# EAGLE design practice_2022 (EAGLE 9.6.2)
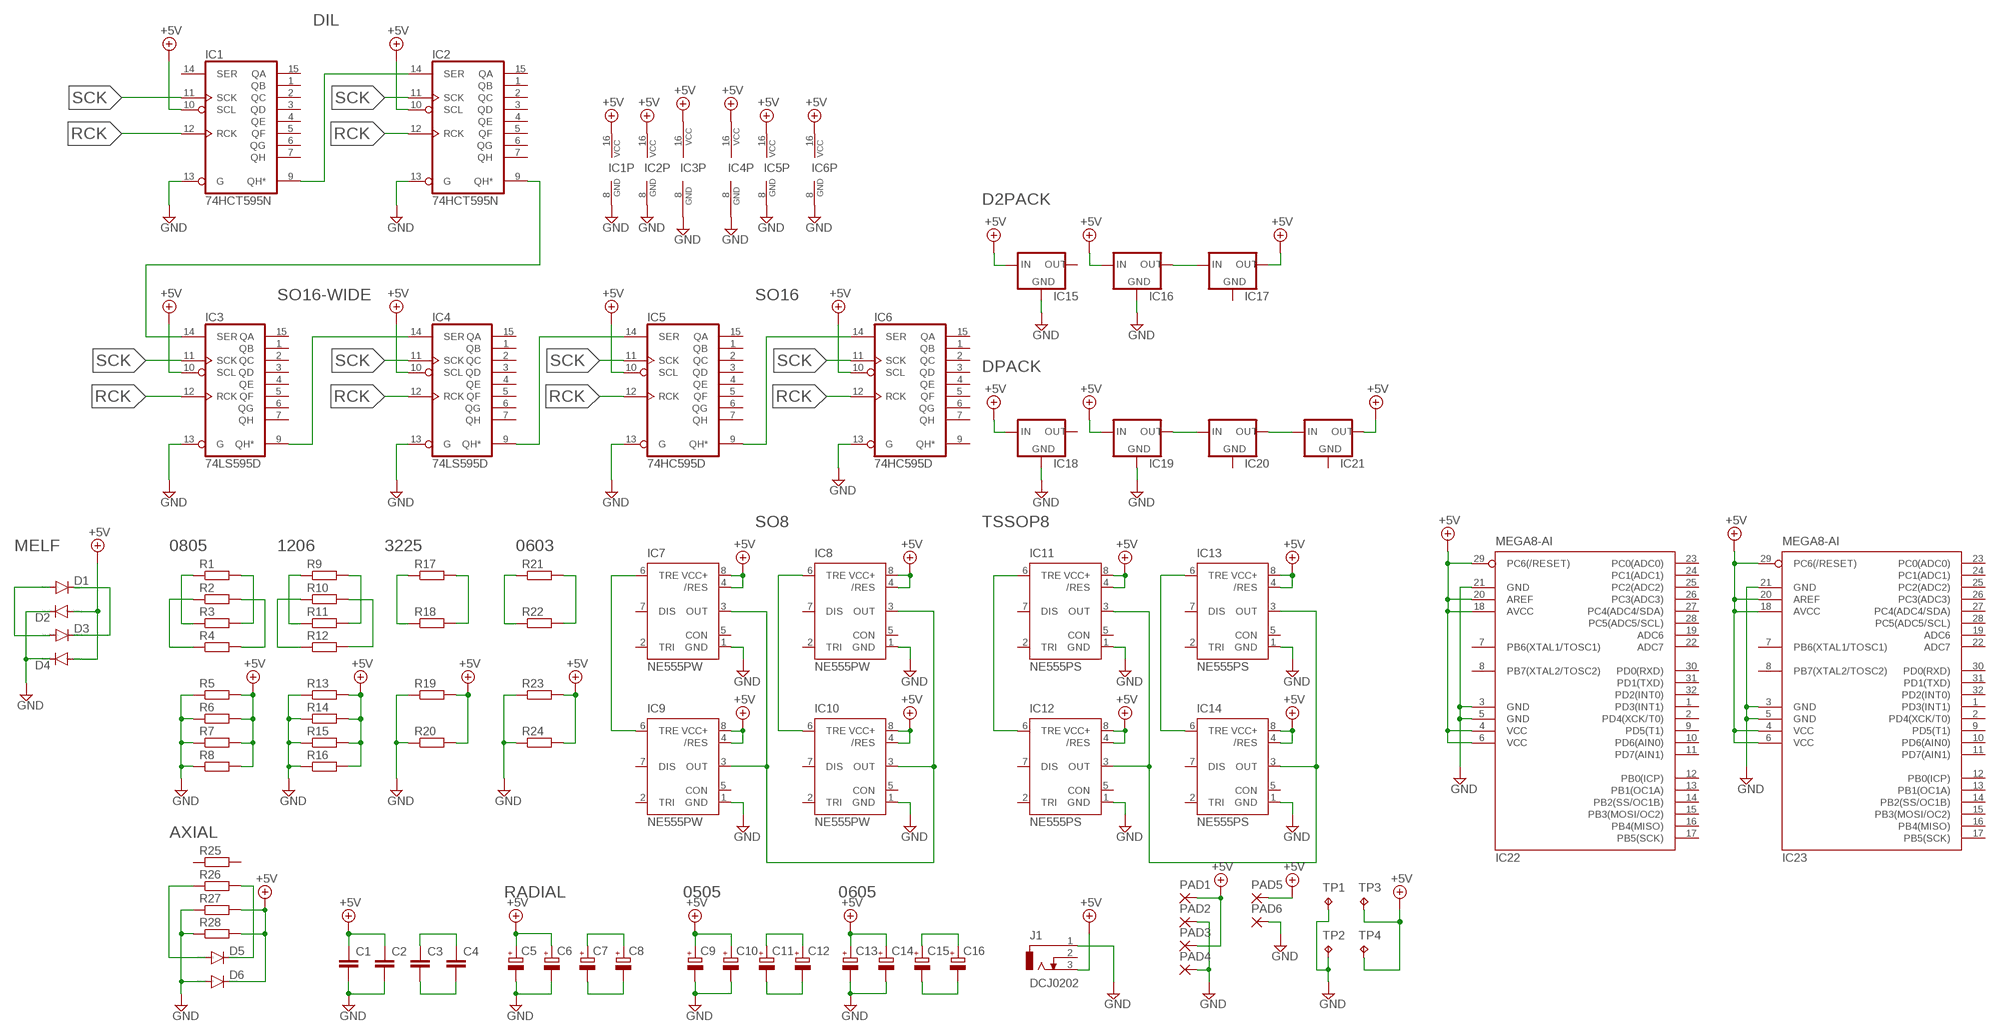
[diagram p0: schematic, sheet 1]

## Parts
C1  C-EU050-024X044  [C050-024X044]
C2  C-EU050-024X044  [C050-024X044]
C3  C-EU050-024X044  [C050-024X044]
C4  C-EU050-024X044  [C050-024X044]
C5  CPOL-EUE5-4  [E5-4]
C6  CPOL-EUE5-4  [E5-4]
C7  CPOL-EUE2,5-6E  [E2,5-6E]
C8  CPOL-EUE2,5-6E  [E2,5-6E]
C9  CPOL-EU153CLV-0505  [153CLV-0505]
C10  CPOL-EU153CLV-0505  [153CLV-0505]
C11  CPOL-EU153CLV-0505  [153CLV-0505]
C12  CPOL-EU153CLV-0505  [153CLV-0505]
C13  CPOL-EU153CLV-0605  [153CLV-0605]
C14  CPOL-EU153CLV-0605  [153CLV-0605]
C15  CPOL-EU153CLV-0605  [153CLV-0605]
C16  CPOL-EU153CLV-0605  [153CLV-0605]
D1  DIODE-MINIMELF  [MINIMELF]
D2  DIODE-MINIMELF  [MINIMELF]
D3  DIODE-MINIMELF  [MINIMELF]
D4  DIODE-MINIMELF  [MINIMELF]
D5  DIODE-DO35-10  [DO35-10]
D6  DIODE-DO35-10  [DO35-10]
IC1  74HCT595N  [DIL16]
IC2  74HCT595N  [DIL16]
IC3  74LS595D  [SO16]
IC4  74LS595D  [SO16]
IC5  74HC595D  [SO16]
IC6  74HC595D  [SO16]
IC7  NE555PW  [TSSOP8]
IC8  NE555PW  [TSSOP8]
IC9  NE555PW  [TSSOP8]
IC10  NE555PW  [TSSOP8]
IC11  NE555PS  [SO08]
IC12  NE555PS  [SO08]
IC13  NE555PS  [SO08]
IC14  NE555PS  [SO08]
IC15  78XX-D2PACK  [D2PACK]
IC16  78XX-D2PACK  [D2PACK]
IC17  78XX-D2PACK  [D2PACK]
IC18  78XX-DPACK  [DPACK]
IC19  78XX-DPACK  [DPACK]
IC20  78XX-DPACK  [DPACK]
IC21  78XX-DPACK  [DPACK]
IC22  MEGA8-AI  [TQFP32-08]
IC23  MEGA8-AI  [TQFP32-08]
J1  DCJ0202  [DCJ0202]
PAD1  SMD2  [SMD1,27-2,54]
PAD2  SMD2  [SMD1,27-2,54]
PAD3  SMD5  [SMD2,54-5,08]
PAD4  SMD5  [SMD2,54-5,08]
PAD5  2,54/1,0  [2,54/1,0]
PAD6  2,54/1,0  [2,54/1,0]
R1  R-EU_R0805  [R0805]
R2  R-EU_R0805  [R0805]
R3  R-EU_R0805  [R0805]
R4  R-EU_R0805  [R0805]
R5  R-EU_R0805  [R0805]
R6  R-EU_R0805  [R0805]
R7  R-EU_R0805  [R0805]
R8  R-EU_R0805  [R0805]
R9  R-EU_R1206  [R1206]
R10  R-EU_R1206  [R1206]
R11  R-EU_R1206  [R1206]
R12  R-EU_R1206  [R1206]
R13  R-EU_R1206  [R1206]
R14  R-EU_R1206  [R1206]
R15  R-EU_R1206  [R1206]
R16  R-EU_R1206  [R1206]
R17  R-EU_R3225  [R3225]
R18  R-EU_R3225  [R3225]
R19  R-EU_R3225  [R3225]
R20  R-EU_R3225  [R3225]
R21  R-EU_R0603  [R0603]
R22  R-EU_R0603  [R0603]
R23  R-EU_R0603  [R0603]
R24  R-EU_R0603  [R0603]
R25  R-EU_0207/12  [0207/12]
R26  R-EU_0207/12  [0207/12]
R27  R-EU_0207/12  [0207/12]
R28  R-EU_0207/12  [0207/12]
TP1  TPTP20SQ  [TP20SQ]
TP2  TPTP20SQ  [TP20SQ]
TP3  TPTP06R  [TP06R]
TP4  TPTP06R  [TP06R]

## Nets
+5V: C1.1 C2.1 C5.+ C6.+ C9.+ C10.+ C13.+ C14.+ D2.A D4.A D6.C IC1.10(SCL) IC1.16(VCC) IC2.10(SCL) IC2.16(VCC) IC3.10(SCL) IC3.16(VCC) IC4.10(SCL) IC4.16(VCC) IC5.10(SCL) IC5.16(VCC) IC6.10(SCL) IC6.16(VCC) IC7.4(/RES) IC7.8(VCC+) IC8.4(/RES) IC8.8(VCC+) IC9.4(/RES) IC9.8(VCC+) IC10.4(/RES) IC10.8(VCC+) IC11.4(/RES) IC11.8(VCC+) IC12.4(/RES) IC12.8(VCC+) IC13.4(/RES) IC13.8(VCC+) IC14.4(/RES) IC14.8(VCC+) IC15.1(IN) IC16.1(IN) IC17.3(OUT) IC18.1(IN) IC19.1(IN) IC21.3(OUT) IC22.4(VCC) IC22.6(VCC) IC22.18(AVCC) IC22.20(AREF) IC22.29(PC6(/RESET)) IC23.4(VCC) IC23.6(VCC) IC23.18(AVCC) IC23.20(AREF) IC23.29(PC6(/RESET)) J1.3 PAD1.1(P) PAD3.1(P) PAD5.1(P) R5.2 R6.2 R7.2 R8.2 R13.2 R14.2 R15.2 R16.2 R19.2 R20.2 R23.2 R24.2 R27.2 R28.2 TP3.TP TP4.TP
GND: C1.2 C2.2 C5.- C6.- C9.- C10.- C13.- C14.- D2.C D4.C D6.A IC1.8(GND) IC1.13(G) IC2.8(GND) IC2.13(G) IC3.8(GND) IC3.13(G) IC4.8(GND) IC4.13(G) IC5.8(GND) IC5.13(G) IC6.8(GND) IC6.13(G) IC7.1(GND) IC8.1(GND) IC9.1(GND) IC10.1(GND) IC11.1(GND) IC12.1(GND) IC13.1(GND) IC14.1(GND) IC15.2(GND) IC16.2(GND) IC18.4(GND) IC19.4(GND) IC22.3(GND) IC22.5(GND) IC22.21(GND) IC23.3(GND) IC23.5(GND) IC23.21(GND) J1.1 PAD2.1(P) PAD4.1(P) PAD6.1(P) R5.1 R6.1 R7.1 R8.1 R13.1 R14.1 R15.1 R16.1 R19.1 R20.1 R23.1 R24.1 R27.1 R28.1 TP1.TP TP2.TP
N$1: IC1.9(QH*) IC2.14(SER)
N$2: R1.2 R3.2
N$3: IC4.9(QH*) IC5.14(SER)
N$4: IC5.9(QH*) IC6.14(SER)
N$5: IC2.9(QH*) IC3.14(SER)
N$6: IC3.9(QH*) IC4.14(SER)
N$7: R1.1 R3.1
N$8: R2.1 R4.1
N$9: R2.2 R4.2
N$10: R9.1 R11.1
N$11: R10.1 R12.1
N$12: R9.2 R11.2
N$13: R10.2 R12.2
N$14: R17.1 R18.1
N$15: R17.2 R18.2
N$16: R21.1 R22.1
N$17: R21.2 R22.2
N$18: IC7.3(OUT) IC8.3(OUT) IC9.3(OUT) IC10.3(OUT)
N$19: IC7.6(TRE) IC9.6(TRE)
N$20: IC8.6(TRE) IC10.6(TRE)
N$21: IC11.3(OUT) IC12.3(OUT) IC13.3(OUT) IC14.3(OUT)
N$22: IC11.6(TRE) IC12.6(TRE)
N$23: D1.A D3.A
N$24: D1.C D3.C
N$25: IC13.6(TRE) IC14.6(TRE)
N$26: IC16.3(OUT) IC17.1(IN)
N$27: IC19.3(OUT) IC20.1(IN)
N$28: IC20.3(OUT) IC21.1(IN)
N$29: D5.A R26.1
N$30: D5.C R26.2
N$31: C3.2 C4.2
N$32: C3.1 C4.1
N$36: C7.+ C8.+
N$37: C7.- C8.-
N$38: C11.+ C12.+
N$39: C11.- C12.-
N$40: C15.+ C16.+
N$41: C15.- C16.-
RCK: IC1.12(RCK) IC2.12(RCK) IC3.12(RCK) IC4.12(RCK) IC5.12(RCK) IC6.12(RCK)
SCK: IC1.11(SCK) IC2.11(SCK) IC3.11(SCK) IC4.11(SCK) IC5.11(SCK) IC6.11(SCK)
Unconnected: IC1.1(QB) IC1.2(QC) IC1.3(QD) IC1.4(QE) IC1.5(QF) IC1.6(QG) IC1.7(QH) IC1.14(SER) IC1.15(QA) IC2.1(QB) IC2.2(QC) IC2.3(QD) IC2.4(QE) IC2.5(QF) IC2.6(QG) IC2.7(QH) IC2.15(QA) IC3.1(QB) IC3.2(QC) IC3.3(QD) IC3.4(QE) IC3.5(QF) IC3.6(QG) IC3.7(QH) IC3.15(QA) IC4.1(QB) IC4.2(QC) IC4.3(QD) IC4.4(QE) IC4.5(QF) IC4.6(QG) IC4.7(QH) IC4.15(QA) IC5.1(QB) IC5.2(QC) IC5.3(QD) IC5.4(QE) IC5.5(QF) IC5.6(QG) IC5.7(QH) IC5.15(QA) IC6.1(QB) IC6.2(QC) IC6.3(QD) IC6.4(QE) IC6.5(QF) IC6.6(QG) IC6.7(QH) IC6.9(QH*) IC6.15(QA) IC7.2(TRI) IC7.5(CON) IC7.7(DIS) IC8.2(TRI) IC8.5(CON) IC8.7(DIS) IC9.2(TRI) IC9.5(CON) IC9.7(DIS) IC10.2(TRI) IC10.5(CON) IC10.7(DIS) IC11.2(TRI) IC11.5(CON) IC11.7(DIS) IC12.2(TRI) IC12.5(CON) IC12.7(DIS) IC13.2(TRI) IC13.5(CON) IC13.7(DIS) IC14.2(TRI) IC14.5(CON) IC14.7(DIS) IC15.3(OUT) IC17.2(GND) IC18.3(OUT) IC20.4(GND) IC21.4(GND) IC22.1(PD3(INT1)) IC22.2(PD4(XCK/T0)) IC22.7(PB6(XTAL1/TOSC1)) IC22.8(PB7(XTAL2/TOSC2)) IC22.9(PD5(T1)) IC22.10(PD6(AIN0)) IC22.11(PD7(AIN1)) IC22.12(PB0(ICP)) IC22.13(PB1(OC1A)) IC22.14(PB2(SS/OC1B)) IC22.15(PB3(MOSI/OC2)) IC22.16(PB4(MISO)) IC22.17(PB5(SCK)) IC22.19(ADC6) IC22.22(ADC7) IC22.23(PC0(ADC0)) IC22.24(PC1(ADC1)) IC22.25(PC2(ADC2)) IC22.26(PC3(ADC3)) IC22.27(PC4(ADC4/SDA)) IC22.28(PC5(ADC5/SCL)) IC22.30(PD0(RXD)) IC22.31(PD1(TXD)) IC22.32(PD2(INT0)) IC23.1(PD3(INT1)) IC23.2(PD4(XCK/T0)) IC23.7(PB6(XTAL1/TOSC1)) IC23.8(PB7(XTAL2/TOSC2)) IC23.9(PD5(T1)) IC23.10(PD6(AIN0)) IC23.11(PD7(AIN1)) IC23.12(PB0(ICP)) IC23.13(PB1(OC1A)) IC23.14(PB2(SS/OC1B)) IC23.15(PB3(MOSI/OC2)) IC23.16(PB4(MISO)) IC23.17(PB5(SCK)) IC23.19(ADC6) IC23.22(ADC7) IC23.23(PC0(ADC0)) IC23.24(PC1(ADC1)) IC23.25(PC2(ADC2)) IC23.26(PC3(ADC3)) IC23.27(PC4(ADC4/SDA)) IC23.28(PC5(ADC5/SCL)) IC23.30(PD0(RXD)) IC23.31(PD1(TXD)) IC23.32(PD2(INT0)) J1.2 R25.1 R25.2

## Notes on the sheet
- DIL
- D2PACK
- SO16-WIDE | SO16
- DPACK
- SO8 | TSSOP8
- MELF | 0805 | 1206 | 3225 | 0603
- AXIAL
- RADIAL | 0505 | 0605

## Library data of the parts
C1-C4 = rcl:C-EU: CAPACITOR, European symbol; SPICEPREFIX: C
C5-C16 = rcl:CPOL-EU: POLARIZED CAPACITOR, European symbol; SPICEPREFIX: C
D1-D6 = diode:DIODE-: DIODE
IC1 IC2 IC5 IC6 = 74xx-eu:74*595: 8-bit SHIFT REGISTER, output latch
IC3 IC4 = 74xx-jp:74*595: 8-bit SHIFT REGISTER, output latch
IC7-IC14 = toyota:NE555: General purpose bipolar Timer
IC15-IC21 = toyota:78XX: VOLTAGE REGULATOR
IC22 IC23 = atmel:MEGA8: MICROCONTROLLER 8 Kbytes FLASH, 1 kbytes SRAM, 512 bytes EEPROM, USART, 6-channel 10 bit ADC, 2-channel 8 bit ADC Pin compatible with Atmega48, ATMega88, ATMega168 Source: avr.lbr; MPN: ATMEGA8-16AU; OC_FARNELL: 9171371; OC_NEWARK: 73M8863
J1 = con-jack:DCJ0202: DC POWER JACK Source: DCJ0202.pdf; OC_FARNELL: unknown; OC_NEWARK: unknown
PAD1 PAD2 = wirepad:SMD2: SMD PAD
PAD3 PAD4 = wirepad:SMD5: SMD PAD
PAD5 PAD6 = wirepad:2,54/1,0: THROUGH-HOLE PAD
R1-R28 = rcl:R-EU_: RESISTOR, European symbol; SPICEPREFIX: R
TP1-TP4 = testpad:TP: Test pad

## Board
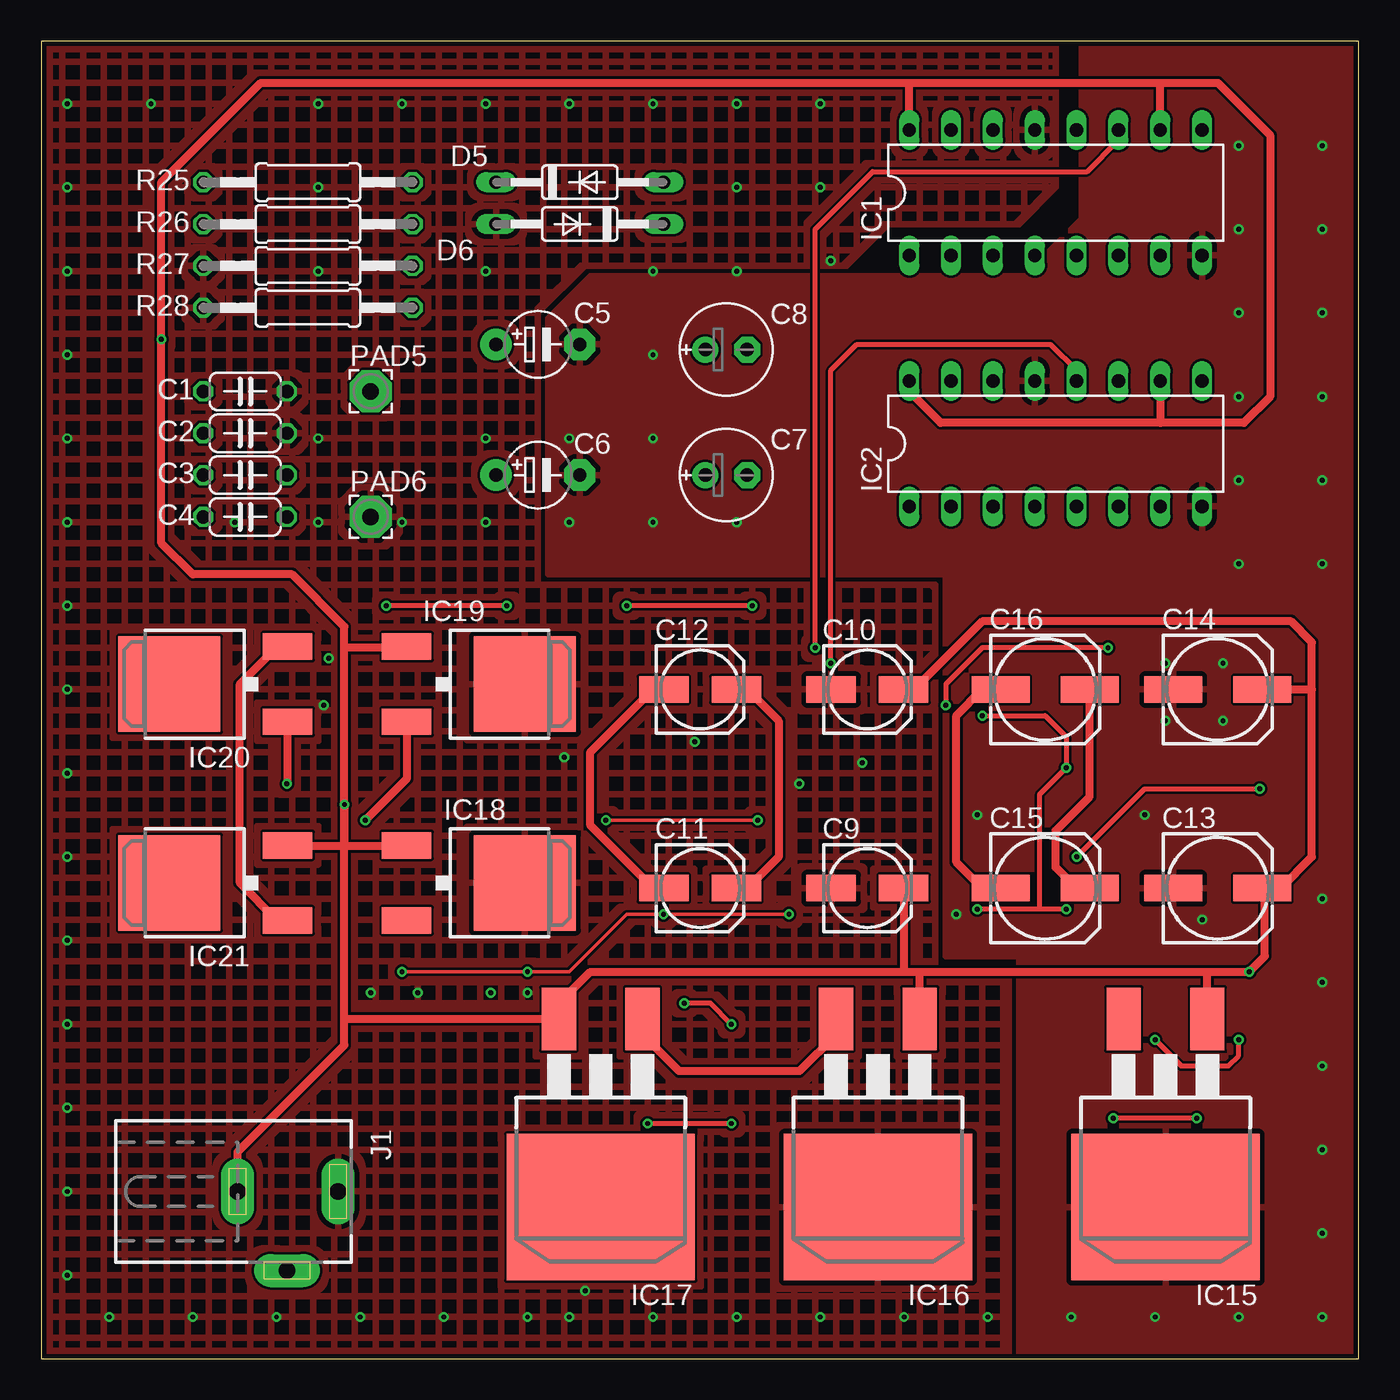
[diagram p1: board, top side]
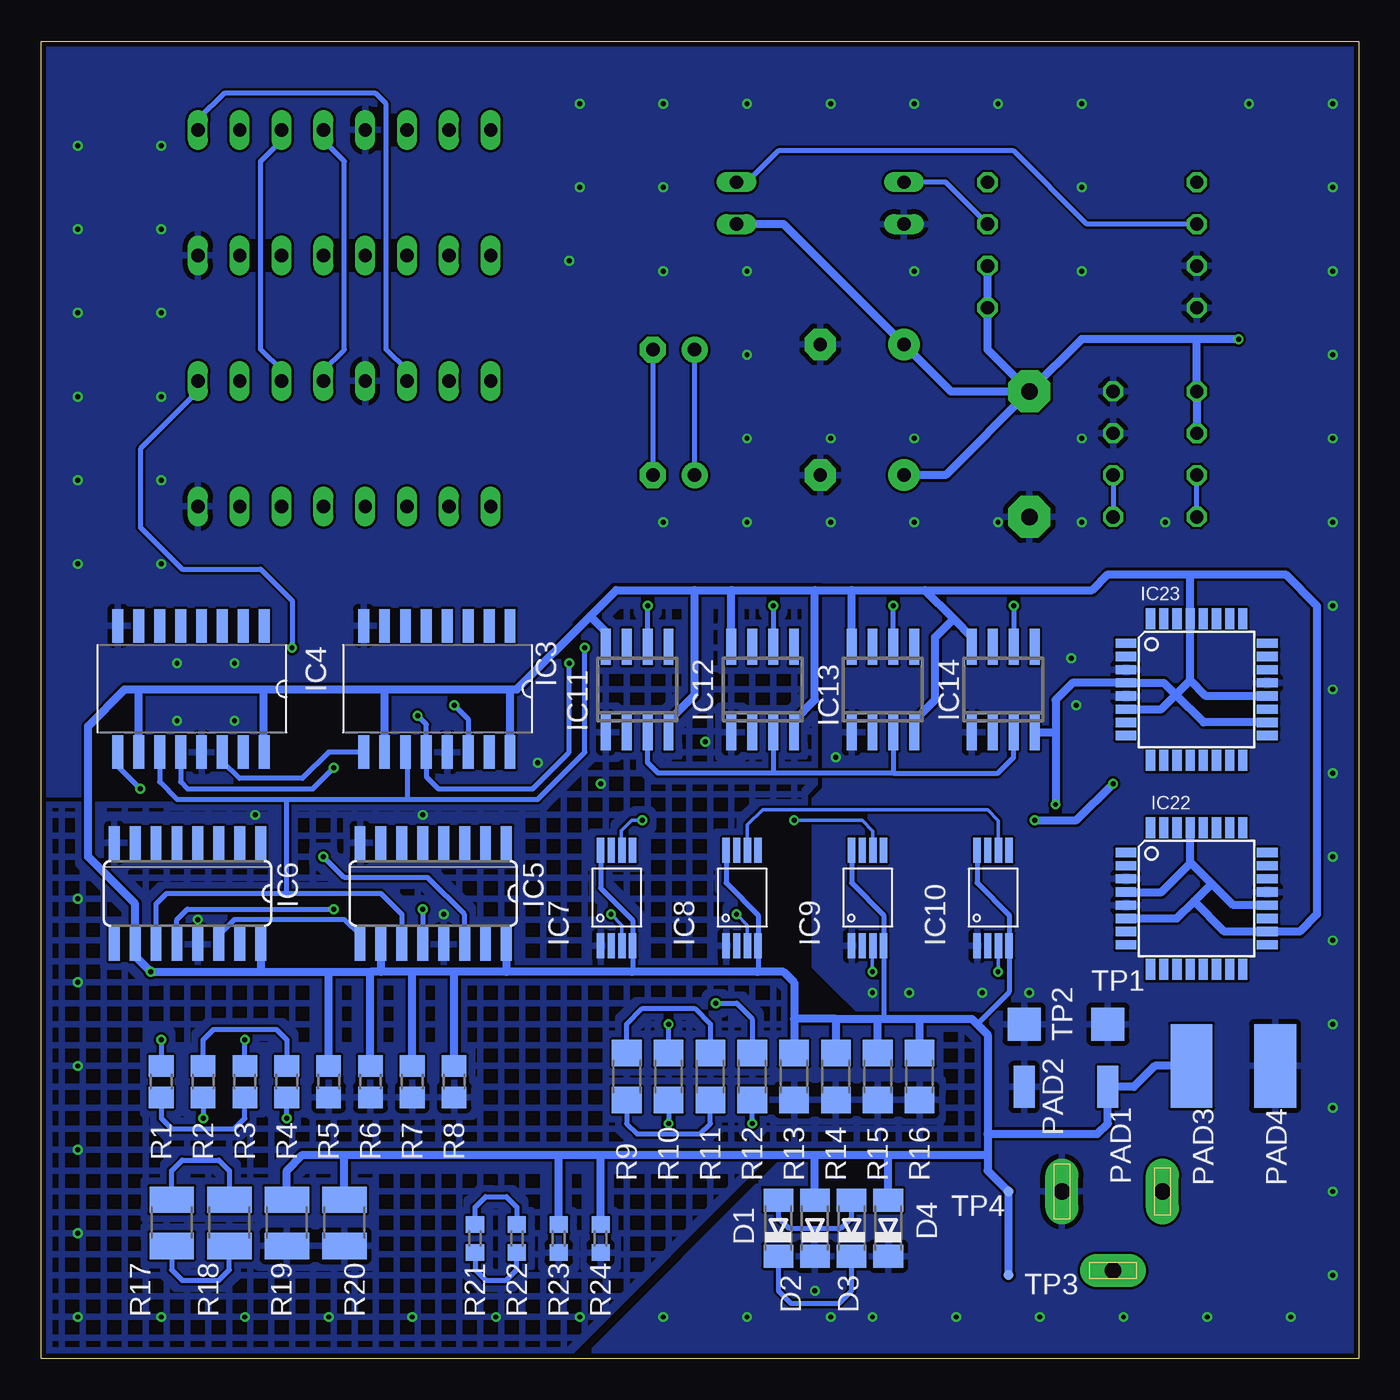
[diagram p2: board, bottom side, seen from below]

Size 80 x 80 mm. Coordinates in mm from the lower left corner, seen from the top.
Outline: 0,0 80,0 80,80 0,80 0,0
Copper layers (1*16): Top 0.035mm / dielectric 1.5mm / Bottom 0.035mm
Design rules "pcbgogo *": minimum track width 3mil, minimum drill 0.2mm, track to track 6mil, track to pad 6mil, pad to pad 6mil, via to via 6mil, smd to smd 6mil, copper to edge 0.3mm, drill to drill 0.25mm, minimum pad ring 0.13mm, minimum via ring 0.13mm, stop-mask expansion 4mil, vias tented up to drill 0mil, thermal gap 0.3mm

### Footprints (pad centres in the part's own frame; a part is rotated, then mirrored left to right if it is on the bottom)
C050-024X044 = drill 0.813 octagon: 1 -2.54,0; 2 2.54,0
E5-4 = drill 0.813 pad 1.905: + -2.54,0 | drill 0.813 pad 1.905 octagon: - 2.54,0
E2,5-6E = drill 0.813 pad 1.575: + -1.27,0 | drill 0.813 pad 1.575 octagon: - 1.27,0
153CLV-0505 = smd 3 x 1.6: + 2.2,0; - -2.2,0
153CLV-0605 = smd 3.5 x 1.6: + 2.7,0; - -2.7,0
MINIMELF = smd 1.4 x 1.8: A 1.7,0; C -1.7,0
DO35-10 = drill 0.813 long: A 5.08,0; C -5.08,0
DIL16 = drill 0.813 long: 1 -8.89,-3.81; 2 -6.35,-3.81; 3 -3.81,-3.81; 4 -1.27,-3.81; 5 1.27,-3.81; 6 3.81,-3.81; 7 6.35,-3.81; 8 8.89,-3.81; 9 8.89,3.81; 10 6.35,3.81; 11 3.81,3.81; 12 1.27,3.81; 13 -1.27,3.81; 14 -3.81,3.81; 15 -6.35,3.81; 16 -8.89,3.81
SO16 = smd 2.032 x 0.66: 1 -3.863,4.03; 2 -3.863,2.76; 3 -3.863,1.49; 4 -3.863,0.22; 5 -3.863,-1.05; 6 -3.863,-2.32; 7 -3.863,-3.59; 8 -3.863,-4.86; 9 3.803,-4.86; 10 3.803,-3.59; 11 3.803,-2.32; 12 3.803,-1.05; 13 3.803,0.22; 14 3.803,1.49; 15 3.803,2.76; 16 3.803,4.03
SO16' = smd 0.66 x 2.032: 1 -4.445,-3.073; 2 -3.175,-3.073; 3 -1.905,-3.073; 4 -0.635,-3.073; 5 0.635,-3.073; 6 1.905,-3.073; 7 3.175,-3.073; 8 4.445,-3.073; 9 4.445,3.073; 10 3.175,3.073; 11 1.905,3.073; 12 0.635,3.073; 13 -0.635,3.073; 14 -1.905,3.073; 15 -3.175,3.073; 16 -4.445,3.073
TSSOP8 = smd 1.5 x 0.45: 1 0,1.905; 2 0,1.255; 3 0,0.605; 4 0,-0.045; 5 5.8,-0.045; 6 5.8,0.605; 7 5.8,1.255; 8 5.8,1.905
SO08 = smd 0.6 x 2.2: 1 -1.905,-2.6; 2 -0.635,-2.6; 3 0.635,-2.6; 4 1.905,-2.6; 5 1.905,2.6; 6 0.635,2.6; 7 -0.635,2.6; 8 -1.905,2.6
D2PACK = smd 2.083 x 3.81: 1 -2.54,-8.89; 3 2.54,-8.89 | smd 11.43 x 8.89: 2 0,2.54
DPACK = smd 1.6 x 3: 1 -2.28,-4.8; 3 2.28,-4.8 | smd 5.8 x 6.2: 4 0,2.38
TQFP32-08 = smd 1.27 x 0.559: 1 -4.293,2.8; 2 -4.293,2; 3 -4.293,1.2; 4 -4.293,0.4; 5 -4.293,-0.4; 6 -4.293,-1.2; 7 -4.293,-2; 8 -4.293,-2.8; 17 4.293,-2.8; 18 4.293,-2; 19 4.293,-1.2; 20 4.293,-0.4; 21 4.293,0.4; 22 4.293,1.2; 23 4.293,2; 24 4.293,2.8 | smd 0.559 x 1.27: 9 -2.8,-4.293; 10 -2,-4.293; 11 -1.2,-4.293; 12 -0.4,-4.293; 13 0.4,-4.293; 14 1.2,-4.293; 15 2,-4.293; 16 2.8,-4.293; 25 2.8,4.293; 26 2,4.293; 27 1.2,4.293; 28 0.4,4.293; 29 -0.4,4.293; 30 -1.2,4.293; 31 -2,4.293; 32 -2.8,4.293
DCJ0202 = drill 1 pad 2 long: 1 0,3.1; 2 4.8,0; 3 0,-3
SMD1,27-2,54 = smd 1.27 x 2.54: 1 0,0
SMD2,54-5,08 = smd 2.54 x 5.08: 1 0,0
2,54/1,0 = drill 1.016 pad 2.54 octagon: 1 0,0
R0805 = smd 1.3 x 1.5: 1 -0.95,0; 2 0.95,0
R1206 = smd 1.6 x 1.803: 1 -1.422,0; 2 1.422,0
R3225 = smd 1.6 x 2.7: 1 -1.4,0; 2 1.4,0
R0603 = smd 1 x 1.1: 1 -0.85,0; 2 0.85,0
0207/12 = drill 0.813 octagon: 1 -6.35,0; 2 6.35,0
TP20SQ = smd 2 x 2: TP 0,0
TP06R = smd 0.6 x 0.6: TP 0,0

### Placement (x,y rotation side)
C1  12.38,58.74 0 top
C2  12.38,56.2 0 top
C3  12.38,53.66 0 top
C4  12.38,51.12 0 top
C5  30.16,61.59 0 top
C6  30.16,53.66 0 top
C7  41.59,53.66 0 top
C8  41.59,61.28 0 top
C9  50.16,28.57 0 top
C10  50.16,40.64 0 top
C11  40.01,28.57 0 top
C12  40.01,40.64 0 top
C13  71.44,28.57 0 top
C14  71.44,40.64 0 top
C15  60.96,28.57 0 top
C16  60.96,40.64 0 top
D1  35.24,7.94 90 bottom
D2  33.02,7.94 90 bottom
D3  30.8,7.94 90 bottom
D4  28.57,7.94 90 bottom
D5  32.7,71.44 0 top
D6  32.7,68.9 180 top
IC1  61.59,70.8 0 top
IC2  61.59,55.56 0 top
IC3  55.56,40.64 270 bottom
IC4  70.48,40.64 270 bottom
IC5  74HC595D  [SO16']  56.2,28.26 180 bottom
IC6  74HC595D  [SO16']  71.12,28.26 180 bottom
IC7  44.13,25.08 90 bottom
IC8  36.51,25.08 90 bottom
IC9  28.89,25.08 90 bottom
IC10  21.27,25.08 90 bottom
IC11  43.81,40.64 0 bottom
IC12  36.2,40.64 0 bottom
IC13  28.89,40.64 0 bottom
IC14  21.59,40.64 0 bottom
IC15  68.26,11.75 180 top
IC16  50.8,11.75 180 top
IC17  33.97,11.75 180 top
IC18  26.99,28.89 270 top
IC19  26.99,40.96 270 top
IC20  10.16,40.96 90 top
IC21  10.16,28.89 90 top
IC22  9.84,27.94 0 bottom
IC23  9.84,40.64 0 bottom
J1  14.92,10.16 270 top
PAD1  15.24,16.51 0 bottom
PAD2  20.32,16.51 0 bottom
PAD3  10.16,17.78 0 bottom
PAD4  5.08,17.78 0 bottom
PAD5  20,58.74 0 top
PAD6  20,51.12 0 top
R1  72.71,16.83 90 bottom
R2  70.17,16.83 90 bottom
R3  67.63,16.83 90 bottom
R4  65.09,16.83 90 bottom
R5  62.55,16.83 90 bottom
R6  60.01,16.83 90 bottom
R7  57.47,16.83 90 bottom
R8  54.93,16.83 90 bottom
R9  44.45,17.14 90 bottom
R10  41.91,17.14 90 bottom
R11  39.37,17.14 90 bottom
R12  36.83,17.14 90 bottom
R13  34.29,17.14 90 bottom
R14  31.75,17.14 90 bottom
R15  29.21,17.14 90 bottom
R16  26.67,17.14 90 bottom
R17  72.07,8.26 90 bottom
R18  68.58,8.26 90 bottom
R19  65.09,8.26 90 bottom
R20  61.59,8.26 90 bottom
R21  53.66,7.3 90 bottom
R22  51.12,7.3 90 bottom
R23  48.58,7.3 90 bottom
R24  46.04,7.3 90 bottom
R25  16.19,71.44 0 top
R26  16.19,68.9 0 top
R27  16.19,66.36 0 top
R28  16.19,63.82 0 top
TP1  15.24,20.32 0 bottom
TP2  20.32,20.32 0 bottom
TP3  21.27,5.08 0 bottom
TP4  21.27,10.16 0 bottom

### Tracks (layer width: path | path; a pad name or v marks a point on that pad's centre or on a via)
+5V  (via drill 0.3 pad 0.6)
  Top 0.5: J1.3 11.92,12.56 18.41,19.05 18.41,20.64 | 18.41,20.64 v18.41,33.66 | v18.41,33.66 18.41,31.11 | v18.41,33.66 18.41,43.18 | 18.41,43.18 18.41,44.45 15.24,47.62 9.21,47.62 7.3,49.53 v7.3,61.91 7.3,71.44 13.34,77.47 52.7,77.47 | IC18.1 22.13,31.11 18.41,31.11 | 18.41,31.11 15.02,31.11 IC21.3 | 18.41,20.64 IC17.3 31.43,21.59 33.34,23.5 52.39,23.5 | 52.39,23.5 53.34,23.5 | 53.34,23.5 70.8,23.5 | 70.8,23.5 v73.34,23.5 74.3,24.45 74.3,28.42 C13.+ 75.25,28.57 77.15,30.48 77.15,40.64 | IC15.1 70.8,23.5 | IC16.1 53.34,23.5 | 52.7,77.47 67.94,77.47 | 67.94,77.47 71.44,77.47 74.61,74.3 74.61,58.42 73.03,56.83 67.94,56.83 | 67.94,56.83 54.61,56.83 52.7,58.74 IC2.16 | IC2.10 67.94,56.83 | IC1.10 67.94,77.47 | IC1.16 52.7,77.47 | C10.+ 53.02,40.64 57.15,44.77 75.88,44.77 77.15,43.5 77.15,40.64 | C14.+ 77.15,40.64 | 18.41,43.18 22.54,43.18 22.48,43.24 IC19.1 | C9.+ 52.37,23.52 52.39,23.5
  Bottom 0.3: 44.13,23.5 44.09,23.54 IC7.4 44.09,26.62 46.04,28.57 IC7.8 | 36.51,23.5 36.47,23.54 IC8.4 36.47,26.94 38.42,28.89 IC8.8 | 28.89,20.64 28.85,20.68 IC9.4 28.85,26.94 30.8,28.89 IC9.8 | 23.18,20.32 21.23,22.27 IC10.4 21.23,26.94 23.18,28.89 IC10.8
  Bottom 0.5: PAD5.1 25.08,53.66 C6.+ | PAD5.1 22.54,61.28 R28.2 R27.2 | C2.1 C1.1 9.84,61.91 | v7.3,61.91 9.84,61.91 | 9.84,61.91 16.83,61.91 PAD5.1 | D6.C 34.92,68.9 C5.+ 24.77,58.74 PAD5.1 | 66.67,23.5 v73.34,23.5 74.3,24.45 IC6.10 74.3,27.62 77.15,30.48 77.15,38.42 74.93,40.64 73.98,40.64 | 66.67,23.5 62.55,23.5 | 62.55,23.5 60.01,23.5 | 51.75,23.5 44.13,23.5 36.51,23.5 34.92,23.5 34.29,22.86 34.29,20.64 | 51.75,23.5 54.93,23.5 | 54.93,23.5 57.47,23.5 | 57.47,23.5 59.37,23.5 | 59.37,23.5 60.01,23.5 | 31.75,20.64 R14.2 | 34.29,20.64 R13.2 | 31.75,20.64 34.29,20.64 | 31.75,20.64 29.21,20.64 | 29.21,20.64 28.89,20.64 26.67,20.64 | 26.67,20.64 23.5,20.64 23.18,20.32 22.54,19.68 22.54,13.65 | 22.54,13.65 22.54,12.38 | 22.54,12.38 22.54,11.43 TP4.TP TP3.TP | R16.2 26.67,20.64 | R15.2 29.21,20.64 | R5.2 62.55,23.5 | R6.2 60.01,23.5 | R7.2 57.47,23.5 | R8.2 54.93,23.5 | IC5.10 59.37,23.5 | IC5.16 51.75,23.5 | IC6.16 66.67,23.5 | 73.98,40.64 66.48,40.64 | 51.44,40.64 51.12,40.64 46.67,45.09 | 24.61,44.93 26.35,46.67 | 24.61,44.93 23.5,43.81 IC14.8 | 46.67,45.09 45.09,46.67 40.32,46.67 | 40.32,46.67 38.1,46.67 | 38.1,46.67 33.02,46.67 | 33.02,46.67 30.8,46.67 | 30.8,46.67 26.35,46.67 | IC13.8 30.8,46.67 | IC12.8 38.1,46.67 | IC11.8 45.72,44.13 46.67,45.09 | IC11.4 41.91,38.73 40.32,40.32 40.32,46.67 | IC12.4 34.29,38.73 33.02,40.01 33.02,46.67 | IC13.4 26.99,38.73 25.72,40.01 25.72,43.81 24.61,44.93 | R19.2 65.09,11.43 64.14,12.38 61.59,12.38 | 61.59,12.38 48.58,12.38 | 48.58,12.38 46.04,12.38 | 46.04,12.38 33.02,12.38 | 33.02,12.38 28.57,12.38 | 28.57,12.38 22.54,12.38 | D4.A 28.57,12.38 | D2.A 33.02,12.38 | R20.2 61.59,12.38 | R23.2 48.58,12.38 | R24.2 46.04,12.38
  Bottom 0.5: 22.54,13.65 15.88,13.65 15.24,14.29 PAD1.1 13.65,16.51 12.38,17.78 PAD3.1 | 26.35,46.67 16.19,46.67 15.24,47.62 10.16,47.62 | 10.16,47.62 4.45,47.62 2.54,45.72 2.54,26.99 3.59,25.94 IC22.18 8.16,25.94 10,27.78 | IC22.20 7.62,27.54 8.93,28.85 | IC22.4 11.98,28.34 10.24,30.08 | 10.24,30.08 IC22.29 | 10.24,30.08 10.16,30.08 8.93,28.85 | 10,27.78 11.04,26.74 IC22.6 | 10,27.78 8.93,28.85 | 10.16,47.62 10.24,47.54 IC23.29 10.24,41.19 | 18.41,38.1 18.41,40.01 17.38,41.04 IC23.4 11.83,41.04 11.11,40.32 | 18.41,38.1 v18.41,33.66 | IC23.6 11.99,39.44 11.11,40.32 | 11.11,40.32 10.24,41.19 | IC23.18 9.43,38.64 11.11,40.32 | IC23.20 9.29,40.24 10.24,41.19 | 66.48,40.64 66.48,36.87 IC4.16 | IC4.10 74.08,40.54 73.98,40.64 | IC3.16 51.53,40.54 51.44,40.64 | IC14.4 18.48,38.04 18.41,38.1 | 66.48,40.64 59.05,40.64 | 59.05,40.64 51.44,40.64 | IC3.10 59.15,40.54 59.05,40.64
GND  (via drill 0.3 pad 0.6)
  other vias: 77.79,27.94 77.79,22.86 77.79,17.78 77.79,12.7 77.79,7.62 77.79,2.54 72.71,2.54 67.63,2.54 62.55,2.54 57.47,2.54 52.39,2.54 47.31,2.54 42.23,2.54 37.15,2.54 32.07,2.54 29.53,2.54 24.45,2.54 19.37,2.54 14.29,2.54 9.21,2.54 4.13,2.54 1.59,5.08 1.59,10.16 1.59,15.24 1.59,20.32 1.59,25.4 1.59,30.48 1.59,35.56 1.59,40.64 1.59,45.72 1.59,50.8 1.59,55.88 1.59,60.96 1.59,66.04 1.59,71.12 1.59,76.2 6.67,76.2 16.83,76.2 21.91,76.2 26.99,76.2 32.07,76.2 37.15,76.2 42.23,76.2 47.31,76.2 77.79,48.26 77.79,53.34 77.79,58.42 77.79,63.5 77.79,68.58 77.79,73.66 72.71,73.66 72.71,68.58 72.71,63.5 72.71,58.42 72.71,53.34 72.71,48.26 42.23,71.12 47.31,71.12 47.94,66.67 42.23,66.04 42.23,50.8 37.15,50.8 37.15,55.88 37.15,60.96 37.15,66.04 32.07,50.8 26.99,50.8 21.91,50.8 16.83,50.8 16.83,55.88 11.75,50.8 16.83,66.04 16.83,71.12 26.99,66.04 26.99,55.88 32.07,55.88 70.48,26.67 66.99,33.02 56.83,33.02 49.85,36.2 29.53,22.23 27.3,22.23 22.86,22.23 20,22.23 46.04,34.92 71.75,38.73 68.26,38.73 71.75,42.23 68.26,42.23 33.02,4.13 17.14,39.69 17.46,42.55 31.75,36.51 39.69,37.47 55.56,26.99
  pour Top: 79.69,79.69 79.69,0.32 59.37,0.32 59.37,24.45 54.93,24.45 54.93,47.62 30.8,47.62 30.8,63.18 33.34,65.72 59.69,65.72 63.18,69.22 63.18,79.69
  pour Top (hatched): 61.59,79.69 61.59,71.12 59.37,68.9 51.44,68.9 48.9,66.36 33.02,66.36 30.16,63.5 30.16,46.99 54.29,46.99 54.29,23.81 58.74,23.81 58.74,0.32 0.32,0.32 0.32,79.69
  pour Bottom (hatched): 79.69,0.32 47.94,0.32 35.88,12.38 22.54,12.38 22.54,19.68 23.5,20.64 30.8,20.64 33.66,23.5 33.66,34.29 33.02,34.92 33.02,46.67 45.09,46.67 47.31,44.45 47.31,36.2 49.85,33.66 79.69,33.66
  pour Bottom: 0.32,0.32 0.32,79.69 79.69,79.69 79.69,34.29 50.48,34.29 47.94,36.83 47.94,44.77 45.4,47.31 32.38,47.31 32.38,34.61 33.02,33.97 33.02,23.81 31.75,22.54 30.48,21.27 29.53,21.27 23.18,21.27 21.91,20 21.91,18.73 21.91,11.75 35.24,11.75 46.67,0.32
N$1
  Bottom 0.3: IC2.14 57.78,60.01 59.05,61.28 59.05,76.2 59.69,76.83 68.9,76.83 70.48,75.25 IC1.9
N$2  (via drill 0.3 pad 0.6)
  Top 0.3: v67.63,19.37 69.22,17.78 72.07,17.78 72.71,18.41 v72.71,19.37
  Bottom 0.3: R3.2 v67.63,19.37 | v72.71,19.37 R1.2
N$3  (via drill 0.3 pad 0.6)
  Top 0.3: v62.87,30.48 66.99,34.61 v73.98,34.61
  Bottom 0.3: IC5.14 54.29,26.99 56.52,29.21 61.59,29.21 v62.87,30.48 | v73.98,34.61 74.61,35.24 75.34,35.98 IC4.9
N$4
  Bottom 0.3: IC5.9 60.64,25.72 61.59,26.67 68.26,26.67 69.22,25.72 IC6.14
N$5  (via drill 0.3 pad 0.6)
  Top 0.3: v64.77,43.18 57.15,43.18 54.93,40.96 v54.93,39.69
  Bottom 0.3: IC2.9 70.48,58.74 73.98,55.24 73.98,50.48 71.44,47.94 66.67,47.94 64.77,46.04 v64.77,43.18 | IC3.14 54.07,38.83 v54.93,39.69
N$6
  Bottom 0.3: IC3.9 62.54,36.84 64.14,35.24 67.94,35.24 69,36.29 IC4.14
N$7
  Bottom 0.3: R1.1 72.71,14.61 72.07,13.97 68.26,13.97 67.63,14.61 R3.1
N$8  (via drill 0.3 pad 0.6)
  Top 0.3: v70.17,14.61 v65.09,14.61
  Bottom 0.3: R2.1 v70.17,14.61 | v65.09,14.61 R4.1
N$9
  Bottom 0.3: R2.2 70.17,19.37 69.53,20 65.72,20 65.09,19.37 R4.2
N$10
  Bottom 0.3: R9.1 44.45,14.29 43.81,13.65 40.01,13.65 39.37,14.29 R11.1
N$11  (via drill 0.3 pad 0.6)
  Top 0.3: v41.91,14.29 v36.83,14.29
  Bottom 0.3: R10.1 v41.91,14.29 | v36.83,14.29 R12.1
N$12
  Bottom 0.3: R9.2 44.45,20.32 43.5,21.27 40.32,21.27 39.37,20.32 R11.2
N$13  (via drill 0.3 pad 0.6)
  Top 0.3: v41.91,20.32 40.64,21.59 v39.05,21.59
  Bottom 0.3: R10.2 v41.91,20.32 | v39.05,21.59 37.78,21.59 36.83,20.64 R12.2
N$14
  Bottom 0.3: R17.1 72.07,5.4 71.44,4.76 69.22,4.76 68.58,5.4 R18.1
N$15
  Bottom 0.3: R17.2 72.07,11.43 71.44,12.06 69.22,12.06 68.58,11.43 R18.2
N$16
  Bottom 0.3: R21.1 53.66,5.4 53.02,4.76 51.75,4.76 51.12,5.4 R22.1
N$17
  Bottom 0.3: R21.2 53.66,9.21 53.02,9.84 51.75,9.84 51.12,9.21 R22.2
N$18  (via drill 0.3 pad 0.6)
  Top 0.2: v45.4,26.99 v37.78,26.99 35.56,26.99 34.77,26.19 32.07,23.5 v29.53,23.5 v21.91,23.5
  Bottom 0.2: IC7.3 44.74,26.32 v45.4,26.99 | v37.78,26.99 37.12,26.32 IC8.3 | v29.53,23.5 29.53,25.05 IC9.3 | v21.91,23.5 21.88,23.52 IC10.3
N$19  (via drill 0.3 pad 0.6)
  Top 0.2: v34.29,32.7 v43.5,32.7
  Bottom 0.2: IC9.6 29.5,32.04 30.16,32.7 v34.29,32.7 | v43.5,32.7 44.13,32.7 44.77,32.07 44.77,30.91 IC7.6
N$20
  Bottom 0.2: IC8.6 37.12,32.41 36.2,33.34 22.54,33.34 21.88,32.67 IC10.6
N$21
  Bottom 0.3: 28.26,35.56 21.91,35.56 20.95,36.51 IC14.3 | IC13.3 28.26,35.56 | IC11.3 43.18,36.2 42.55,35.56 35.56,35.56 | 28.26,35.56 35.56,35.56 | IC12.3 35.56,35.56
N$22  (via drill 0.3 pad 0.6)
  Top 0.3: v43.18,45.72 v35.56,45.72
  Bottom 0.3: IC11.6 v43.18,45.72 | v35.56,45.72 IC12.6
N$23
  Bottom 0.3: D1.A 35.24,8.57 34.61,7.94 31.43,7.94 30.8,8.57 D3.A
N$24
  Bottom 0.3: D1.C 35.24,4.13 34.48,3.37 31.56,3.37 30.8,4.13 D3.C
N$25  (via drill 0.3 pad 0.6)
  Top 0.3: v28.26,45.72 v20.95,45.72
  Bottom 0.3: IC13.6 v28.26,45.72 | v20.95,45.72 IC14.6
N$26
  Top 0.5: IC16.3 48.26,19.68 46.04,17.46 38.73,17.46 36.51,19.68 IC17.1
N$27  (via drill 0.3 pad 0.6)
  Top 0.5: IC19.3 22.19,35.2 v19.68,32.7 | v14.92,34.92 14.96,34.96 IC20.1
  Bottom 0.5: v19.68,32.7 17.14,32.7 v14.92,34.92
N$28
  Top 0.5: IC21.1 14.35,26.61 12.06,28.89 12.06,40.96 14.35,43.24 IC20.3
N$29
  Bottom 0.3: R26.1 16.51,68.9 20.95,73.34 35.24,73.34 37.15,71.44 D5.A
N$30
  Bottom 0.3: R26.2 25.08,71.44 D5.C
N$31
  Bottom 0.3: C3.2 C4.2
N$32
  Bottom 0.3: C4.1 C3.1
N$36
  Bottom 0.3: C7.+ C8.+
N$37
  Bottom 0.3: C8.- C7.-
N$38
  Top 0.5: C12.+ 42.86,40.64 44.77,38.73 44.77,30.48 42.86,28.57 C11.+
N$39
  Top 0.5: C11.- 37.15,28.57 33.34,32.38 33.34,36.83 37.15,40.64 C12.-
N$40
  Top 0.5: C15.+ 62.87,28.57 61.59,29.84 61.59,32.07 63.66,34.13 C16.+
N$41
  Top 0.5: C15.- 57.15,28.57 55.56,30.16 55.56,39.05 57.15,40.64 C16.-
RCK  (via drill 0.3 pad 0.6)
  Top 0.3: v57.15,39.05 60.96,39.05 62.23,37.78 v62.23,35.88 60.64,34.29 60.64,27.3 | v62.23,27.3 60.64,27.3 | 60.64,27.3 v56.83,27.3 | IC2.12 62.87,60.01 61.28,61.59 49.53,61.59 47.94,60.01 v47.94,42.23
  Bottom 0.3: IC2.12 62.87,60.01 61.59,61.28 61.59,72.71 62.87,73.98 IC1.12 | IC4.12 71.53,35.02 71.12,34.61 63.5,34.61 v62.23,35.88 | v57.15,39.05 56.61,38.52 IC3.12 56.61,35.34 55.88,34.61 50.16,34.61 47.94,36.83 v47.94,42.23 | IC6.12 71.75,26.67 71.12,27.3 v62.23,27.3 | v56.83,27.3 IC5.12
SCK  (via drill 0.3 pad 0.6)
  Top 0.3: v46.99,43.18 46.99,53.66 46.99,68.58 50.48,72.07 63.5,72.07 65.41,73.98 IC1.11
  Bottom 0.3: IC2.11 65.41,60.01 66.67,61.28 66.67,72.71 65.41,73.98 IC1.11 | IC4.11 72.81,35.02 71.75,33.97 65.09,33.97 | 57.78,33.97 57.78,36.74 IC3.11 | IC6.11 73.03,27.62 72.39,28.26 65.09,28.26 | 65.09,28.26 59.37,28.26 58.1,26.99 IC5.11 | 65.09,28.26 65.09,33.97 | 65.09,33.97 57.78,33.97 | 57.78,33.97 49.85,33.97 46.99,36.83 v46.99,43.18